# Altium project Water_Board.PrjPcb
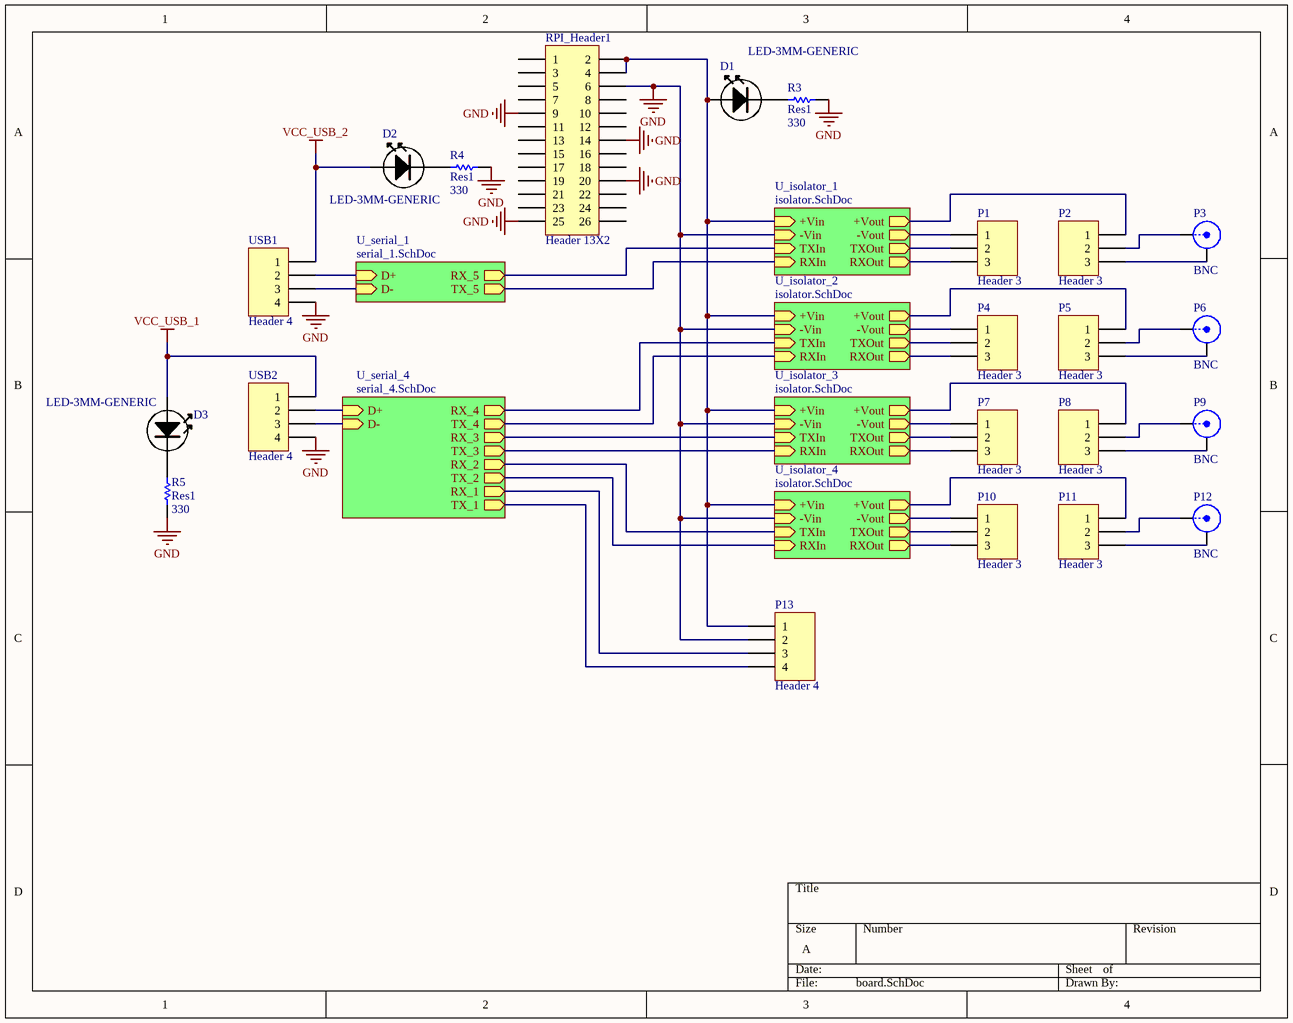
[diagram p0: board.SchDoc]
4 sheets, 80 parts. Net scope: hierarchical (ports join the sheet entries above them; power ports are global).
Board file: board_pcb.PcbDoc
Sheets:
  board.SchDoc
    U_isolator_1 = isolator.SchDoc
    U_isolator_2 = isolator.SchDoc
    U_isolator_3 = isolator.SchDoc
    U_isolator_4 = isolator.SchDoc
    U_serial_1 = serial_1.SchDoc
    U_serial_4 = serial_4.SchDoc

## Sheet board.SchDoc
size A

### Parts
D1  LED-3MM-GENERIC
D2  LED-3MM-GENERIC
D3  LED-3MM-GENERIC
P1  Header 3  [HDR1X3]
P2  Header 3  [HDR1X3]
P3  BNC  [BNC_RA CON]
P4  Header 3  [HDR1X3]
P5  Header 3  [HDR1X3]
P6  BNC  [BNC_RA CON]
P7  Header 3  [HDR1X3]
P8  Header 3  [HDR1X3]
P9  BNC  [BNC_RA CON]
P10  Header 3  [HDR1X3]
P11  Header 3  [HDR1X3]
P12  BNC  [BNC_RA CON]
P13  Header 4  [HDR1X4]
R3  Res1  value 330  [0805R-330]
R4  Res1  value 330  [0805R-330]
R5  Res1  value 330  [0805R-330]
RPI_Header1  Header 13X2  [HDR2X13]
USB1  Header 4  [HDR1X4]
USB2  Header 4  [HDR1X4]

### Sub-sheets
U_isolator_1 = isolator.SchDoc: +Vin (in), -Vin (in), +Vout (out), -Vout (out), TXIn (in), RXIn (in), TXOut (out), RXOut (out)
U_isolator_2 = isolator.SchDoc: +Vin (in), -Vin (in), +Vout (out), -Vout (out), TXIn (in), RXIn (in), TXOut (out), RXOut (out)
U_isolator_3 = isolator.SchDoc: +Vin (in), -Vin (in), +Vout (out), -Vout (out), TXIn (in), RXIn (in), TXOut (out), RXOut (out)
U_isolator_4 = isolator.SchDoc: +Vin (in), -Vin (in), +Vout (out), -Vout (out), TXIn (in), RXIn (in), TXOut (out), RXOut (out)
U_serial_1 = serial_1.SchDoc: RX_5 (out), TX_5 (out), D+ (in), D- (in)
U_serial_4 = serial_4.SchDoc: RX_4 (out), TX_4 (out), RX_3 (out), TX_3 (out), RX_2 (out), TX_2 (out), RX_1 (out), TX_1 (out), D+ (in), D- (in)

### Nets
GND: P13.2 R3.2 R4.2 R5.1 RPI_Header1.6 RPI_Header1.9 RPI_Header1.14 RPI_Header1.20 RPI_Header1.25 USB1.4 USB2.4 ; sheet U_isolator_1/-Vin, sheet U_isolator_2/-Vin, sheet U_isolator_3/-Vin, sheet U_isolator_4/-Vin
VCC_USB_1: D3.A USB2.1
VCC_USB_2: D2.A USB1.1
NetC14_U_isolator_1_1: P1.1 ; sheet U_isolator_1/-Vout
NetC14_U_isolator_1_2: P2.1 ; sheet U_isolator_1/+Vout
NetC14_U_isolator_2_1: P4.1 ; sheet U_isolator_2/-Vout
NetC14_U_isolator_2_2: P5.1 ; sheet U_isolator_2/+Vout
NetC14_U_isolator_3_1: P7.1 ; sheet U_isolator_3/-Vout
NetC14_U_isolator_3_2: P8.1 ; sheet U_isolator_3/+Vout
NetC14_U_isolator_4_1: P10.1 ; sheet U_isolator_4/-Vout
NetC14_U_isolator_4_2: P11.1 ; sheet U_isolator_4/+Vout
NetC15_U_isolator_1_2: D1.A P13.1 RPI_Header1.2 RPI_Header1.4 ; sheet U_isolator_1/+Vin, sheet U_isolator_2/+Vin, sheet U_isolator_3/+Vin, sheet U_isolator_4/+Vin
NetD1_K: D1.K R3.1
NetD2_K: D2.K R4.1
NetD3_K: D3.K R5.2
NetP1_2: P1.2 ; sheet U_isolator_1/TXOut
NetP1_3: P1.3 ; sheet U_isolator_1/RXOut
NetP2_2: P2.2 P3.1(X)
NetP2_3: P2.3 P3.2(Y)
NetP4_2: P4.2 ; sheet U_isolator_2/TXOut
NetP4_3: P4.3 ; sheet U_isolator_2/RXOut
NetP5_2: P5.2 P6.1(X)
NetP5_3: P5.3 P6.2(Y)
NetP7_2: P7.2 ; sheet U_isolator_3/TXOut
NetP7_3: P7.3 ; sheet U_isolator_3/RXOut
NetP8_2: P8.2 P9.1(X)
NetP8_3: P8.3 P9.2(Y)
NetP10_2: P10.2 ; sheet U_isolator_4/TXOut
NetP10_3: P10.3 ; sheet U_isolator_4/RXOut
NetP11_2: P11.2 P12.1(X)
NetP11_3: P11.3 P12.2(Y)
NetP13_3: P13.3 ; sheet U_serial_4/RX_1
NetP13_4: P13.4 ; sheet U_serial_4/TX_1
NetR6_U_isolator_1_1: sheet U_isolator_1/TXIn, sheet U_serial_1/RX_5
NetR6_U_isolator_2_1: sheet U_isolator_2/TXIn, sheet U_serial_4/RX_4
NetR6_U_isolator_3_1: sheet U_isolator_3/TXIn, sheet U_serial_4/RX_3
NetR6_U_isolator_4_1: sheet U_isolator_4/TXIn, sheet U_serial_4/RX_2
NetR7_U_isolator_1_1: sheet U_isolator_1/RXIn, sheet U_serial_1/TX_5
NetR7_U_isolator_2_1: sheet U_isolator_2/RXIn, sheet U_serial_4/TX_4
NetR7_U_isolator_3_1: sheet U_isolator_3/RXIn, sheet U_serial_4/TX_3
NetR7_U_isolator_4_1: sheet U_isolator_4/RXIn, sheet U_serial_4/TX_2
NetU1_7: USB2.2 ; sheet U_serial_4/D+
NetU1_8: USB2.3 ; sheet U_serial_4/D-
NetU2_15: USB1.3 ; sheet U_serial_1/D-
NetU2_16: USB1.2 ; sheet U_serial_1/D+

Not connected (* = marked no-connect by the designer): RPI_Header1 1 3 5 7 8 10 11 12 13 15 16 17 18 19 21 22 23 24 26

### Library data of the parts
D1-D3 = LED-3MM-GENERIC: GENERIC LED 3MM
P1 P2 P4 P5 P7 P8 P10 P11 = Header 3: Header, 3-Pin; LatestRevisionDate: 17-Jul-2002; LatestRevisionNote: Re-released for DXP Platform.; Publisher: Altium Limited
P3 P6 P9 P12 = BNC: BNC Elbow Connector; LatestRevisionDate: 17-Jul-2002; LatestRevisionNote: Re-released for DXP Platform.; Publisher: Altium Limited
P13 USB1 USB2 = Header 4: Header, 4-Pin; LatestRevisionDate: 17-Jul-2002; LatestRevisionNote: Re-released for DXP Platform.; Publisher: Altium Limited
R3-R5 = Res1: Resistor; Published: 8-Jun-2000; LatestRevisionDate: 17-Jul-2002; LatestRevisionNote: Re-released for DXP Platform.; PackageReference: AXIAL-0.3; Publisher: Altium Limited; PackageDescription: Axial Device, Thru-Hole; 2 Leads; 0.3 in Pin Spacing
RPI_Header1 = Header 13X2: Header, 13-Pin, Dual row; LatestRevisionDate: 17-Jul-2002; LatestRevisionNote: Re-released for DXP Platform.; Publisher: Altium Limited

## Sheet isolator.SchDoc
size A
Used 4 times, as channels U_isolator_1, U_isolator_2, U_isolator_3, U_isolator_4. Parts and nets are listed once, with the designators drawn on the sheet.
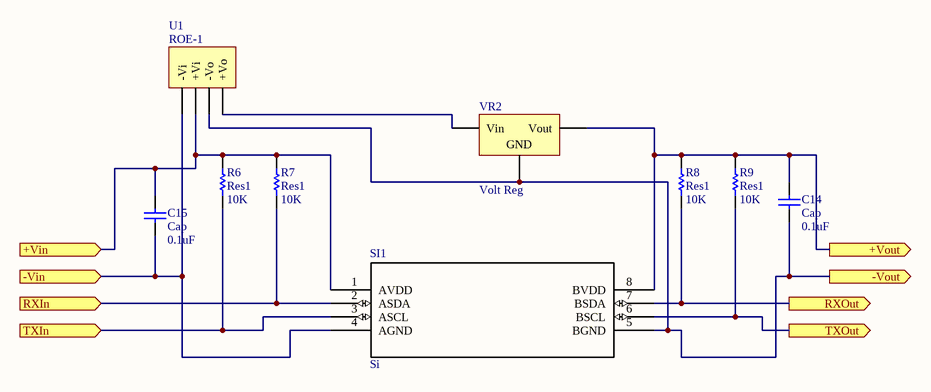
[diagram p1: isolator.SchDoc]

### Parts
C14  Cap  value 0.1uF  [C0805]
C15  Cap  value 0.1uF  [C0805]
R6  Res1  value 10K  [0805R-10K]
R7  Res1  value 10K  [0805R-10K]
R8  Res1  value 10K  [0805R-10K]
R9  Res1  value 10K  [0805R-10K]
ROE-1  U1  [HDR1X4]
SI1  Si  [SOIC-8]
VR2  Volt Reg  [SOT23-123]

### Ports
+Vin (in), +Vout (out), -Vin (in), -Vout (out), RXIn (in), RXOut (out), TXIn (in), TXOut (out)

### Nets
+Vin: C15.2 R6.2 R7.2 ROE-1.2(+Vi) SI1.1(AVDD) ; port +Vin
+Vout: C14.2 R8.2 R9.2 SI1.8(BVDD) VR2.3(Vout) ; port +Vout
-Vin: C15.1 ROE-1.1(-Vi) SI1.4(AGND) ; port -Vin
-Vout: C14.1 ROE-1.3(-Vo) SI1.5(BGND) VR2.2(GND) ; port -Vout
RXIn: R7.1 SI1.2(ASDA) ; port RXIn
RXOut: R8.1 SI1.7(BSDA) ; port RXOut
TXIn: R6.1 SI1.3(ASCL) ; port TXIn
TXOut: R9.1 SI1.6(BSCL) ; port TXOut
NetROE-1_4: ROE-1.4(+Vo) VR2.1(Vin)

### Channels
U_isolator_1: designators end in _U_isolator_1; ports +Vin=NetC15_U_isolator_1_2 +Vout=NetC14_U_isolator_1_2 -Vin=GND -Vout=NetC14_U_isolator_1_1 RXIn=NetR7_U_isolator_1_1 RXOut=NetP1_3 TXIn=NetR6_U_isolator_1_1 TXOut=NetP1_2
U_isolator_2: designators end in _U_isolator_2; ports +Vin=NetC15_U_isolator_1_2 +Vout=NetC14_U_isolator_2_2 -Vin=GND -Vout=NetC14_U_isolator_2_1 RXIn=NetR7_U_isolator_2_1 RXOut=NetP4_3 TXIn=NetR6_U_isolator_2_1 TXOut=NetP4_2
U_isolator_3: designators end in _U_isolator_3; ports +Vin=NetC15_U_isolator_1_2 +Vout=NetC14_U_isolator_3_2 -Vin=GND -Vout=NetC14_U_isolator_3_1 RXIn=NetR7_U_isolator_3_1 RXOut=NetP7_3 TXIn=NetR6_U_isolator_3_1 TXOut=NetP7_2
U_isolator_4: designators end in _U_isolator_4; ports +Vin=NetC15_U_isolator_1_2 +Vout=NetC14_U_isolator_4_2 -Vin=GND -Vout=NetC14_U_isolator_4_1 RXIn=NetR7_U_isolator_4_1 RXOut=NetP10_3 TXIn=NetR6_U_isolator_4_1 TXOut=NetP10_2

### Library data of the parts
C14 C15 = Cap: Capacitor; Published: 8-Jun-2000; LatestRevisionDate: 17-Jul-2002; LatestRevisionNote: Re-released for DXP Platform.; PackageReference: RAD-0.3; Publisher: Altium Limited; PackageDescription: Radial Cap, Thru-Hole; 2 Leads; 0.3 in Pin Spacing
R6-R9 = Res1: Resistor; Published: 8-Jun-2000; LatestRevisionDate: 17-Jul-2002; LatestRevisionNote: Re-released for DXP Platform.; PackageReference: AXIAL-0.3; Publisher: Altium Limited; PackageDescription: Axial Device, Thru-Hole; 2 Leads; 0.3 in Pin Spacing
ROE-1 = Header 4: Header, 4-Pin; LatestRevisionDate: 17-Jul-2002; LatestRevisionNote: Re-released for DXP Platform.; Publisher: Altium Limited
SI1 = Si8600AC-B-IS: Imported; RefDes: RefDes; Type: DEV; Value: Value
VR2 = Volt Reg: Voltage Regulator; pin to pad: 1>3 2>1 3>2; Published: 24-Mar-1999; LatestRevisionDate: 29-May-2009; LatestRevisionNote: IPC-7351 Footprint Added.; PackageReference: D2PAK; Publisher: Altium Limited; PackageDescription: 3-Pin Transistor Outline Package 2.54 mm Pitch, 15.1 mm Lead Span

## Sheet serial_1.SchDoc
size A
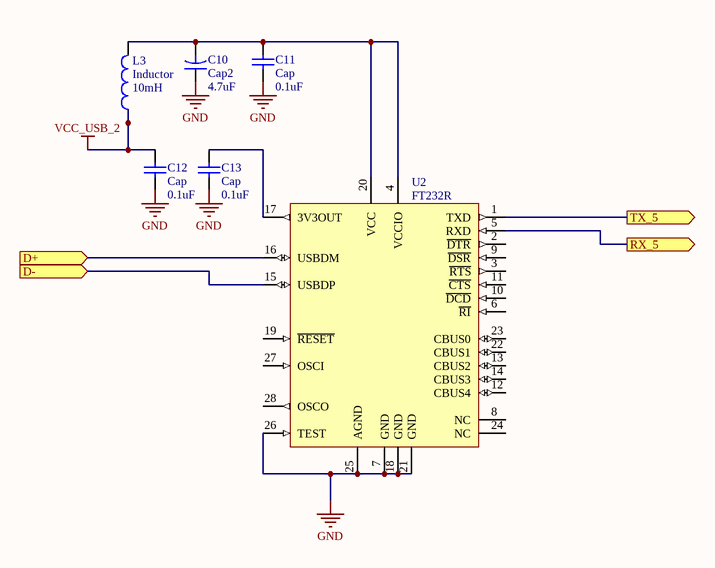
[diagram p2: serial_1.SchDoc]

### Parts
C10  Cap2  value 4.7uF  [CAPR5-4X5]
C11  Cap  value 0.1uF  [C0805]
C12  Cap  value 0.1uF  [C0805]
C13  Cap  value 0.1uF  [C0805]
L3  Inductor  value 10mH  [C0805]
U2  FT232R  [SSOP-28_N]

### Ports
D+ (in), D- (in), RX_5 (out), TX_5 (out)

### Nets
GND: C10.1 C11.1 C12.1 C13.1 U2.7(GND) U2.18(GND) U2.21(GND) U2.25(AGND) U2.26(TEST)
VCC_USB_2: C12.2 L3.1
NetC10_2: C10.2 C11.2 L3.2 U2.4(VCCIO) U2.20(VCC)
NetC13_2: C13.2 U2.17(3V3OUT)
NetR6_U_isolator_1_1: U2.5(RXD) ; port RX_5
NetR7_U_isolator_1_1: U2.1(TXD) ; port TX_5
NetU2_15: U2.15(USBDP) ; port D-
NetU2_16: U2.16(USBDM) ; port D+

Not connected (* = marked no-connect by the designer): U2 2(~{DTR}) 3(~{RTS}) 6(~{RI}) 8(NC) 9(~{DSR}) 10(~{DCD}) 11(~{CTS}) 12(CBUS4) 13(CBUS2) 14(CBUS3) 19(~{RESET}) 22(CBUS1) 23(CBUS0) 24(NC) 27(OSCI) 28(OSCO)

### Library data of the parts
C10 = Cap2: Capacitor; Published: 23-Sep-2002; PackageReference: CAPR5-4X5; Publisher: Altium Limited; PackageDescription: Capacitor; 2 Leads
C11-C13 = Cap: Capacitor; Published: 8-Jun-2000; LatestRevisionDate: 17-Jul-2002; LatestRevisionNote: Re-released for DXP Platform.; PackageReference: RAD-0.3; Publisher: Altium Limited; PackageDescription: Radial Cap, Thru-Hole; 2 Leads; 0.3 in Pin Spacing
L3 = Inductor: Code_IEC: 1005; Published: 8-Jun-2000; LatestRevisionDate: 29-May-2009; LatestRevisionNote: IPC-7351 Footprint Added.; PackageReference: 0402-A; Publisher: Altium Limited; PackageDescription: Chip Inductor; Code_JEITA: 0402
U2 = FT232RL-Tray: USB UART Asynchronous Serial Data Transfer Chip, SSOP-28, Tray; Published: 19-Aug-2010; DatasheetVersion: ver 2.07, Jul-2010; PackageVersion: 2010; PackageReference: SSOP-28; Publisher: Altium Limited; PackageDescription: 28-Pin Small Outline Package 0.65 mm Pitch; ComponentLink1Description: Manufacturer Link; ComponentLink1URL: http://www.ftdichip.com/Products/ICs/FT232R.htm; ComponentLink2Description: Datasheet; ComponentLink2URL: http://www.ftdichip.com/Support/Documents/DataSheets/ICs/DS_FT232R.pdf

## Sheet serial_4.SchDoc
size A
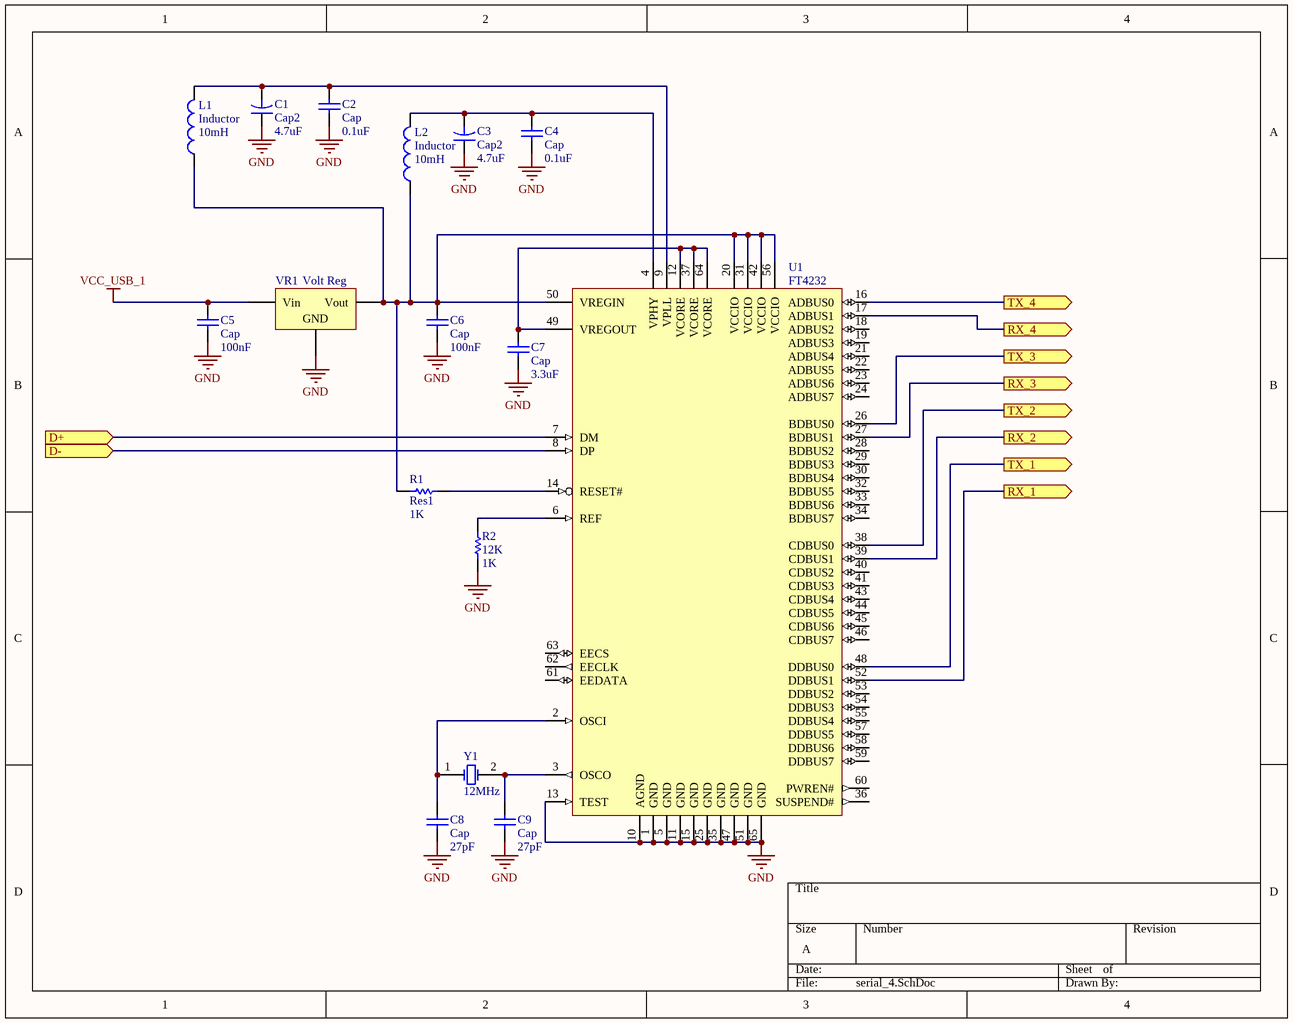
[diagram p3: serial_4.SchDoc]

### Parts
C1  Cap2  value 4.7uF  [CAPR5-4X5]
C2  Cap  value 0.1uF  [C0805]
C3  Cap2  value 4.7uF  [CAPR5-4X5]
C4  Cap  value 0.1uF  [C0805]
C5  Cap  value 100nF  [C0805]
C6  Cap  value 100nF  [C0805]
C7  Cap  value 3.3uF  [C0805]
C8  Cap  value 27pF  [C0805]
C9  Cap  value 27pF  [C0805]
L1  Inductor  value 10mH  [C0805]
L2  Inductor  value 10mH  [C0805]
R1  Res1  value 1K  [0805R-1K]
R2  12K  value 1K  [0805R-12K]
U1  FT4232  [QFN64_2_N]
VR1  Volt Reg  [SOT223]
Y1  12MHz  [XTAL-HC49US-7MM]

### Ports
D+ (in), D- (in), RX_1 (out), RX_2 (out), RX_3 (out), RX_4 (out), TX_1 (out), TX_2 (out), TX_3 (out), TX_4 (out)

### Nets
GND: C1.1 C2.1 C3.1 C4.1 C5.1 C6.1 C7.1 C8.1 C9.1 R2.1 U1.1(GND) U1.5(GND) U1.10(AGND) U1.11(GND) U1.13(TEST) U1.15(GND) U1.25(GND) U1.35(GND) U1.47(GND) U1.51(GND) U1.65(GND) VR1.2(GND)
VCC_USB_1: C5.2 VR1.1(Vin)
NetC1_2: C1.2 C2.2 L1.2 U1.9(VPLL)
NetC3_2: C3.2 C4.2 L2.2 U1.4(VPHY)
NetC6_2: C6.2 L1.1 L2.1 R1.2 U1.20(VCCIO) U1.31(VCCIO) U1.42(VCCIO) U1.50(VREGIN) U1.56(VCCIO) VR1.3(Vout)
NetC7_2: C7.2 U1.12(VCORE) U1.37(VCORE) U1.49(VREGOUT) U1.64(VCORE)
NetC8_2: C8.2 U1.2(OSCI) Y1.1(OSC1)
NetC9_2: C9.2 U1.3(OSCO) Y1.2(OSC2)
NetP13_3: U1.52(DDBUS1) ; port RX_1
NetP13_4: U1.48(DDBUS0) ; port TX_1
NetR1_1: R1.1 U1.14(RESET#)
NetR2_2: R2.2 U1.6(REF)
NetR6_U_isolator_2_1: U1.17(ADBUS1) ; port RX_4
NetR6_U_isolator_3_1: U1.27(BDBUS1) ; port RX_3
NetR6_U_isolator_4_1: U1.39(CDBUS1) ; port RX_2
NetR7_U_isolator_2_1: U1.16(ADBUS0) ; port TX_4
NetR7_U_isolator_3_1: U1.26(BDBUS0) ; port TX_3
NetR7_U_isolator_4_1: U1.38(CDBUS0) ; port TX_2
NetU1_7: U1.7(DM) ; port D+
NetU1_8: U1.8(DP) ; port D-

Not connected (* = marked no-connect by the designer): U1 18(ADBUS2) 19(ADBUS3) 21(ADBUS4) 22(ADBUS5) 23(ADBUS6) 24(ADBUS7) 28(BDBUS2) 29(BDBUS3) 30(BDBUS4) 32(BDBUS5) 33(BDBUS6) 34(BDBUS7) 36(SUSPEND#) 40(CDBUS2) 41(CDBUS3) 43(CDBUS4) 44(CDBUS5) 45(CDBUS6) 46(CDBUS7) 53(DDBUS2) 54(DDBUS3) 55(DDBUS4) 57(DDBUS5) 58(DDBUS6) 59(DDBUS7) 60(PWREN#) 61(EEDATA) 62(EECLK) 63(EECS)

### Library data of the parts
C1 C3 = Cap2: Capacitor; Published: 23-Sep-2002; PackageReference: CAPR5-4X5; Publisher: Altium Limited; PackageDescription: Capacitor; 2 Leads
C2 C4-C9 = Cap: Capacitor; Published: 8-Jun-2000; LatestRevisionDate: 17-Jul-2002; LatestRevisionNote: Re-released for DXP Platform.; PackageReference: RAD-0.3; Publisher: Altium Limited; PackageDescription: Radial Cap, Thru-Hole; 2 Leads; 0.3 in Pin Spacing
L1 L2 = Inductor: Code_IEC: 1005; Published: 8-Jun-2000; LatestRevisionDate: 29-May-2009; LatestRevisionNote: IPC-7351 Footprint Added.; PackageReference: 0402-A; Publisher: Altium Limited; PackageDescription: Chip Inductor; Code_JEITA: 0402
R1 R2 = Res1: Resistor; Published: 8-Jun-2000; LatestRevisionDate: 17-Jul-2002; LatestRevisionNote: Re-released for DXP Platform.; PackageReference: AXIAL-0.3; Publisher: Altium Limited; PackageDescription: Axial Device, Thru-Hole; 2 Leads; 0.3 in Pin Spacing
U1 = FT4232HQ-Tray: Quad High Speed USB To Multipurpose UART/MPSSE IC, QFN-64, Tray; Published: 30-Aug-2010; DatasheetVersion: ver 2.08, May-2010; PackageVersion: 2010; PackageReference: QFN64_2; Publisher: Altium Limited; PackageDescription: 64-Pin Quad Flat No-Lead, 9 x 9 mm Body, 0.5 mm Pitch, 4.35 x 4.35 mm Exposed Pad; ComponentLink1Description: Manufacturer Link; ComponentLink1URL: http://www.ftdichip.com/Products/ICs/FT4232H.htm; ComponentLink2Description: Datasheet; ComponentLink2URL: http://www.ftdichip.com/Support/Documents/DataSheets/ICs/DS_FT4232H.pdf
VR1 = Volt Reg: Voltage Regulator; Published: 24-Mar-1999; LatestRevisionDate: 29-May-2009; LatestRevisionNote: IPC-7351 Footprint Added.; PackageReference: D2PAK; Publisher: Altium Limited; PackageDescription: 3-Pin Transistor Outline Package 2.54 mm Pitch, 15.1 mm Lead Span
Y1 = XTAL: Crystal Oscillator; Published: 8-Jun-2000; LatestRevisionDate: 17-Jul-2002; LatestRevisionNote: Re-released for DXP Platform.; PackageReference: R38; Publisher: Altium Limited; PackageDescription: Crystal, Thru-Hole; 2 Leads; Body 3.1 x 8.2 mm (Dia.xH)

## Nets that join several sheets
GND: board (11 pins), U_isolator_1 (C15_U_isolator_1.1 ROE-1_U_isolator_1.1 SI1_U_isolator_1.4), U_isolator_2 (C15_U_isolator_2.1 ROE-1_U_isolator_2.1 SI1_U_isolator_2.4), U_isolator_3 (C15_U_isolator_3.1 ROE-1_U_isolator_3.1 SI1_U_isolator_3.4), U_isolator_4 (C15_U_isolator_4.1 ROE-1_U_isolator_4.1 SI1_U_isolator_4.4), serial_1 (9 pins), serial_4 (22 pins)
VCC_USB_1: board (D3.A USB2.1), serial_4 (C5.2 VR1.1)
VCC_USB_2: board (D2.A USB1.1), serial_1 (C12.2 L3.1)
NetC14_U_isolator_1_1: board (P1.1), U_isolator_1 (C14_U_isolator_1.1 ROE-1_U_isolator_1.3 SI1_U_isolator_1.5 VR2_U_isolator_1.2)
NetC14_U_isolator_1_2: board (P2.1), U_isolator_1 (5 pins)
NetC14_U_isolator_2_1: board (P4.1), U_isolator_2 (C14_U_isolator_2.1 ROE-1_U_isolator_2.3 SI1_U_isolator_2.5 VR2_U_isolator_2.2)
NetC14_U_isolator_2_2: board (P5.1), U_isolator_2 (5 pins)
NetC14_U_isolator_3_1: board (P7.1), U_isolator_3 (C14_U_isolator_3.1 ROE-1_U_isolator_3.3 SI1_U_isolator_3.5 VR2_U_isolator_3.2)
NetC14_U_isolator_3_2: board (P8.1), U_isolator_3 (5 pins)
NetC14_U_isolator_4_1: board (P10.1), U_isolator_4 (C14_U_isolator_4.1 ROE-1_U_isolator_4.3 SI1_U_isolator_4.5 VR2_U_isolator_4.2)
NetC14_U_isolator_4_2: board (P11.1), U_isolator_4 (5 pins)
NetC15_U_isolator_1_2: board (D1.A P13.1 RPI_Header1.2 RPI_Header1.4), U_isolator_1 (5 pins), U_isolator_2 (5 pins), U_isolator_3 (5 pins), U_isolator_4 (5 pins)
NetP1_2: board (P1.2), U_isolator_1 (R9_U_isolator_1.1 SI1_U_isolator_1.6)
NetP1_3: board (P1.3), U_isolator_1 (R8_U_isolator_1.1 SI1_U_isolator_1.7)
NetP4_2: board (P4.2), U_isolator_2 (R9_U_isolator_2.1 SI1_U_isolator_2.6)
NetP4_3: board (P4.3), U_isolator_2 (R8_U_isolator_2.1 SI1_U_isolator_2.7)
NetP7_2: board (P7.2), U_isolator_3 (R9_U_isolator_3.1 SI1_U_isolator_3.6)
NetP7_3: board (P7.3), U_isolator_3 (R8_U_isolator_3.1 SI1_U_isolator_3.7)
NetP10_2: board (P10.2), U_isolator_4 (R9_U_isolator_4.1 SI1_U_isolator_4.6)
NetP10_3: board (P10.3), U_isolator_4 (R8_U_isolator_4.1 SI1_U_isolator_4.7)
NetP13_3: board (P13.3), serial_4 (U1.52)
NetP13_4: board (P13.4), serial_4 (U1.48)
NetR6_U_isolator_1_1: U_isolator_1 (R6_U_isolator_1.1 SI1_U_isolator_1.3), serial_1 (U2.5)
NetR6_U_isolator_2_1: U_isolator_2 (R6_U_isolator_2.1 SI1_U_isolator_2.3), serial_4 (U1.17)
NetR6_U_isolator_3_1: U_isolator_3 (R6_U_isolator_3.1 SI1_U_isolator_3.3), serial_4 (U1.27)
NetR6_U_isolator_4_1: U_isolator_4 (R6_U_isolator_4.1 SI1_U_isolator_4.3), serial_4 (U1.39)
NetR7_U_isolator_1_1: U_isolator_1 (R7_U_isolator_1.1 SI1_U_isolator_1.2), serial_1 (U2.1)
NetR7_U_isolator_2_1: U_isolator_2 (R7_U_isolator_2.1 SI1_U_isolator_2.2), serial_4 (U1.16)
NetR7_U_isolator_3_1: U_isolator_3 (R7_U_isolator_3.1 SI1_U_isolator_3.2), serial_4 (U1.26)
NetR7_U_isolator_4_1: U_isolator_4 (R7_U_isolator_4.1 SI1_U_isolator_4.2), serial_4 (U1.38)
NetU1_7: board (USB2.2), serial_4 (U1.7)
NetU1_8: board (USB2.3), serial_4 (U1.8)
NetU2_15: board (USB1.3), serial_1 (U2.15)
NetU2_16: board (USB1.2), serial_1 (U2.16)